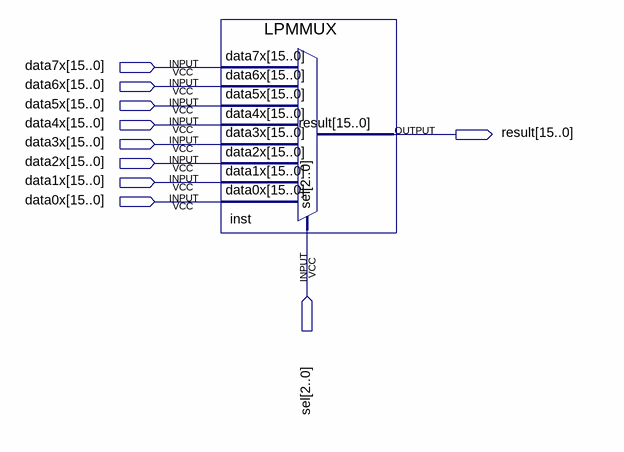
[diagram p0: schematic sheet]
// Quartus schematic lab401LPMMUX.bdf as structural Verilog: 1 symbols, 10 pins
module lab401LPMMUX (
  input  [15:0] data7x,
  input  [15:0] data6x,
  input  [15:0] data5x,
  input  [15:0] data4x,
  input  [15:0] data3x,
  input  [15:0] data2x,
  input  [15:0] data1x,
  input  [15:0] data0x,
  input  [2:0] sel,
  output [15:0] result
);

  LPMMUX inst (
    .data7x(data7x), .data6x(data6x), .data5x(data5x), .data4x(data4x), .data3x(data3x), .data2x(data2x),
    .data1x(data1x), .data0x(data0x), .sel(sel), .result(result));
endmodule
